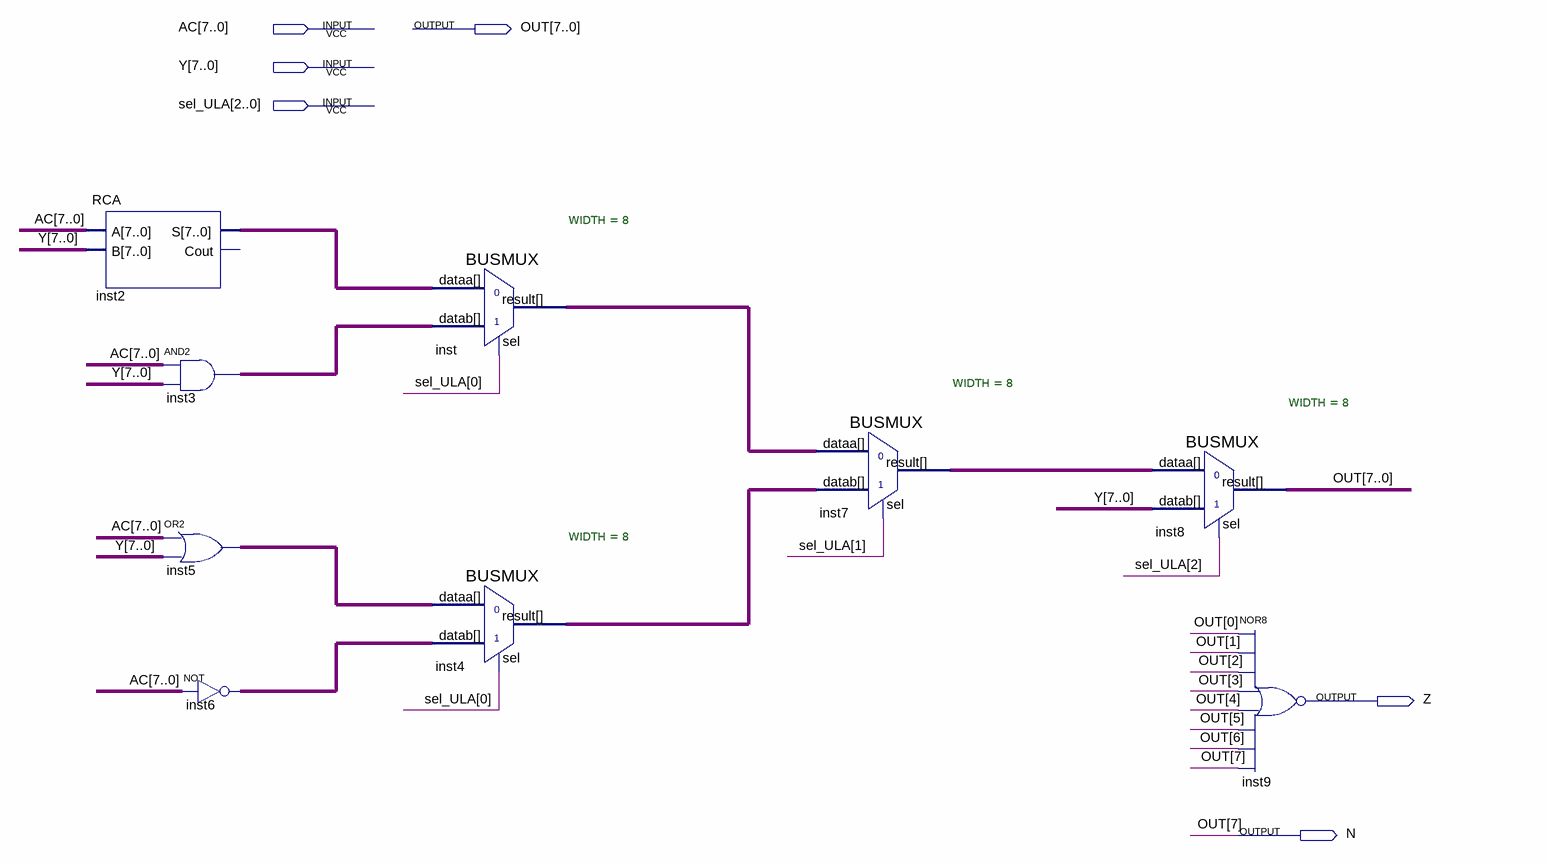
[diagram p0: schematic sheet]
// Quartus schematic ULA.bdf as structural Verilog: 9 symbols, 6 pins
module ULA (
  input  [7:0] AC,
  input  [7:0] Y,
  input  [2:0] sel_ULA,
  output [7:0] OUT,
  output Z,
  output N
);

  wire [7:0] inst2_s, inst3_out, inst4_result, inst5_out, inst6_out, inst7_result, inst_result;

  RCA inst2 (.A(AC), .B(Y), .S(inst2_s));  // open: Cout
  assign inst3_out = AC & Y;  // AND2 inst3, 8 bits wide
  assign inst5_out = AC | Y;  // OR2 inst5, 8 bits wide
  assign inst6_out = ~AC;  // NOT inst6, 8 bits wide
  BUSMUX #(.WIDTH(8)) inst (.datab(inst3_out), .sel(sel_ULA[0]), .dataa(inst2_s), .result(inst_result));
  BUSMUX #(.WIDTH(8)) inst4 (.datab(inst6_out), .sel(sel_ULA[0]), .dataa(inst5_out), .result(inst4_result));
  BUSMUX #(.WIDTH(8)) inst7 (.datab(inst4_result), .sel(sel_ULA[1]), .dataa(inst_result), .result(inst7_result));
  BUSMUX #(.WIDTH(8)) inst8 (.datab(Y), .sel(sel_ULA[2]), .dataa(inst7_result), .result({N, OUT[6:0]}));
  nor inst9 (Z, OUT[0], OUT[1], OUT[2], OUT[3], OUT[4], OUT[5], OUT[6], N);

  assign OUT[7] = N;
endmodule
